# EAGLE design lvds_receiver (EAGLE 7.5.0)
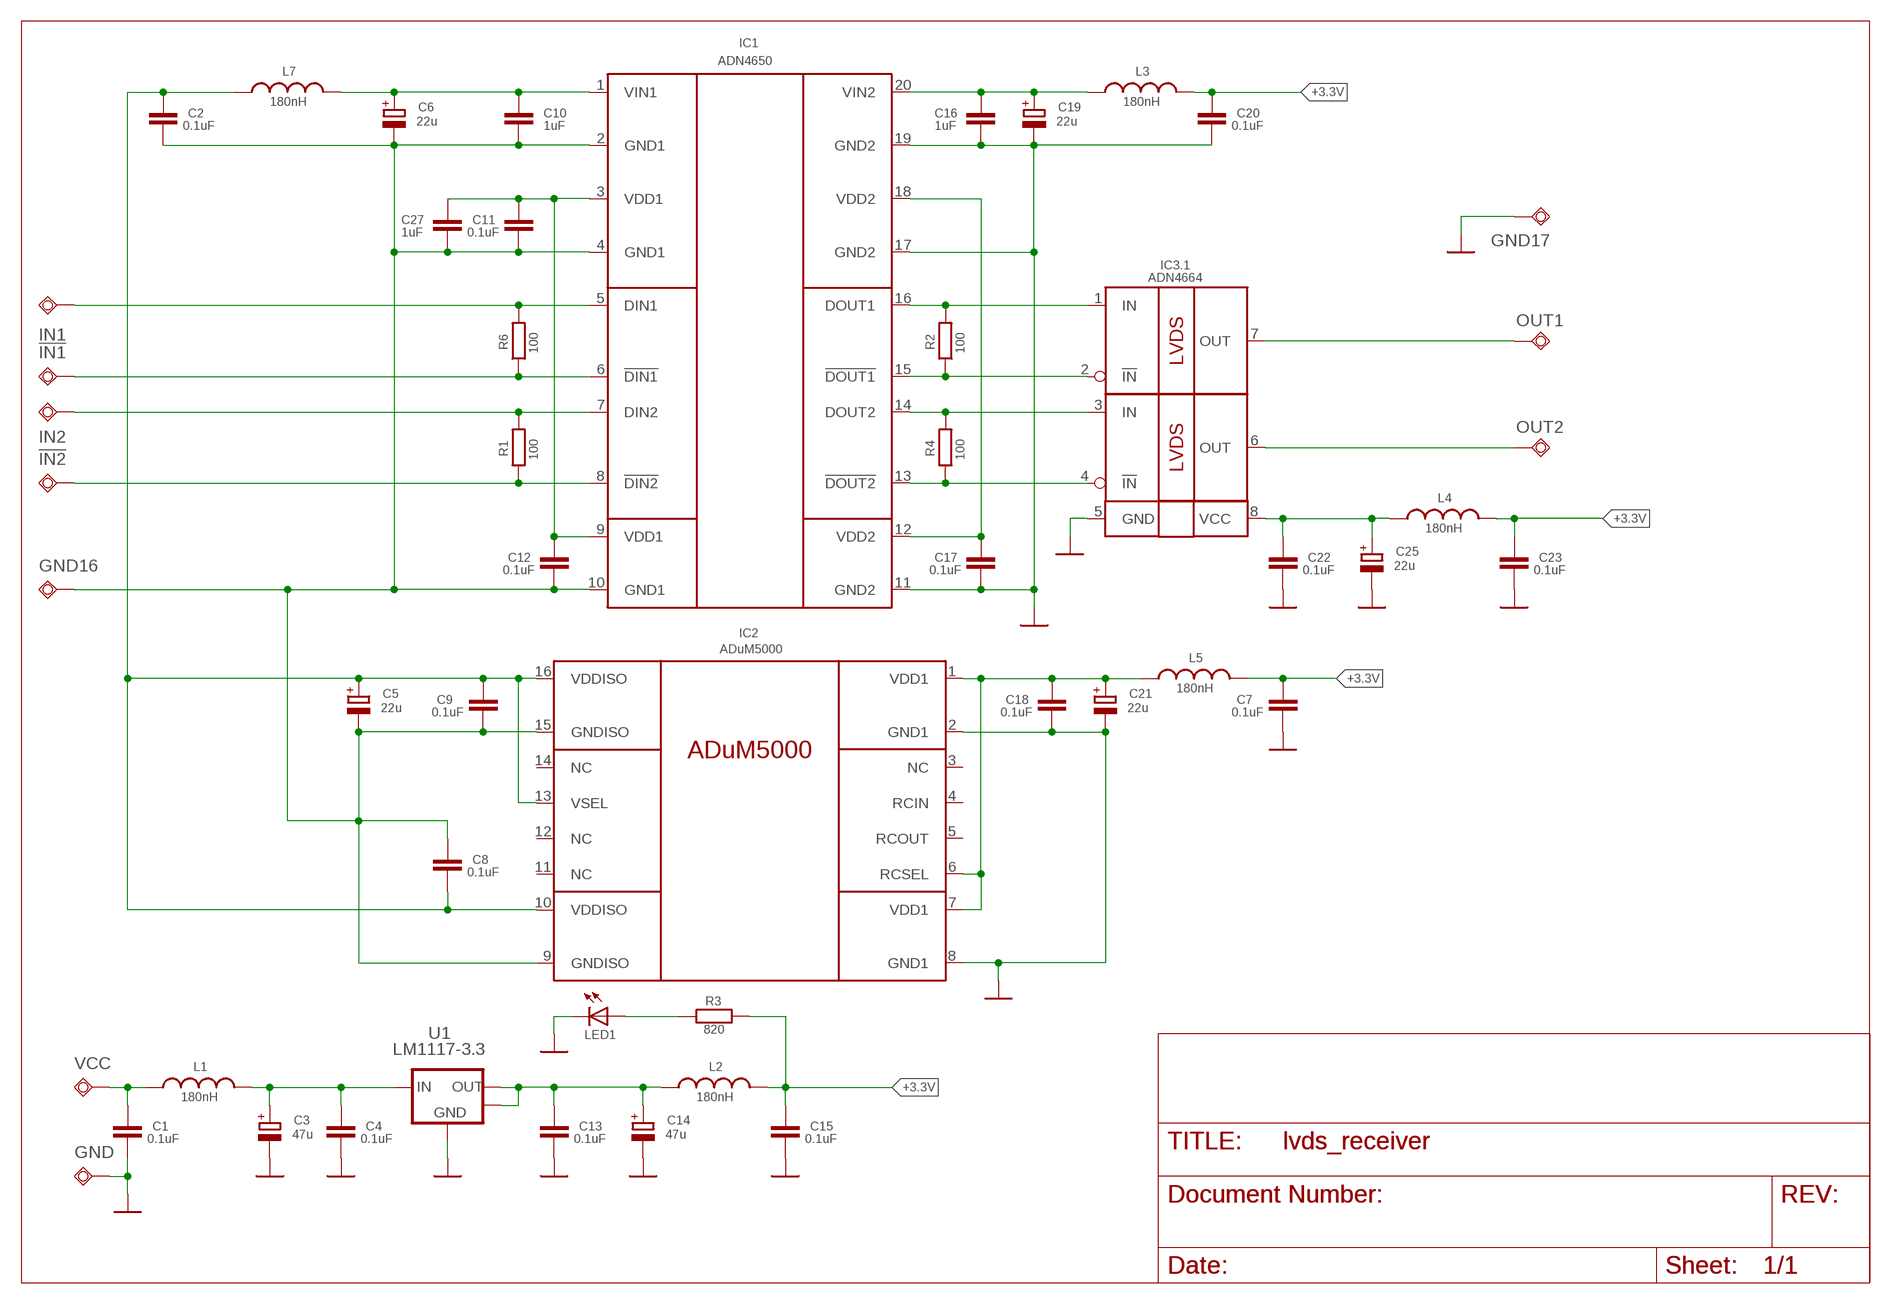
[diagram p0: schematic, sheet 1]

## Parts
!IN1  TPSQTP20R  [TP20R]
!IN2  TPSQTP20R  [TP20R]
C1  0.1uF  C0603  [SMD0603]
C2  0.1uF  C0603  [SMD0603]
C3  47u  CPOL-EUSMCC  [SMC_C]
C4  0.1uF  C0603  [SMD0603]
C5  22u  CPOL-EUSMCA  [SMC_A]
C6  22u  CPOL-EUSMCA  [SMC_A]
C7  0.1uF  C0603  [SMD0603]
C8  0.1uF  C0603  [SMD0603]
C9  0.1uF  C0603  [SMD0603]
C10  1uF  C0603  [SMD0603]
C11  0.1uF  C0603  [SMD0603]
C12  0.1uF  C0603  [SMD0603]
C13  0.1uF  C0603  [SMD0603]
C14  47u  CPOL-EUSMCC  [SMC_C]
C15  0.1uF  C0603  [SMD0603]
C16  1uF  C0603  [SMD0603]
C17  0.1uF  C0603  [SMD0603]
C18  0.1uF  C0603  [SMD0603]
C19  22u  CPOL-EUSMCA  [SMC_A]
C20  0.1uF  C0603  [SMD0603]
C21  22u  CPOL-EUSMCA  [SMC_A]
C22  0.1uF  C0603  [SMD0603]
C23  0.1uF  C0603  [SMD0603]
C25  22u  CPOL-EUSMCA  [SMC_A]
C27  1uF  C0603  [SMD0603]
GND  TPSQTP20R  [TP20R]
GND16  TPSQTP20R  [TP20R]
GND17  TPSQTP20R  [TP20R]
IC1  ADN4650  [SO20W]
IC2  ADuM5000  ADUM5000  [SO16W]
IC3  ADN4664  [SO08]
IN1  TPSQTP20R  [TP20R]
IN2  TPSQTP20R  [TP20R]
L1  180nH  L0603  [SMD0603]
L2  180nH  L0603  [SMD0603]
L3  180nH  L0603  [SMD0603]
L4  180nH  L0603  [SMD0603]
L5  180nH  L0603  [SMD0603]
L7  180nH  L0603  [SMD0603]
LED1  LEDCHIPLED_0805  [CHIPLED_0805]
OUT1  TPSQTP20R  [TP20R]
OUT2  TPSQTP20R  [TP20R]
R1  100  R0603  [SMD0603]
R2  100  R0603  [SMD0603]
R3  820  R0603  [SMD0603]
R4  100  R0603  [SMD0603]
R6  100  R0603  [SMD0603]
U1  LM1117-3.3  [SOT223]
VCC  TPSQTP20R  [TP20R]

## Nets
+3.3V: C7.1 C15.1 C20.1 C23.1 L2.2 L3.2 L4.2 L5.2 R3.2
GND: C1.2 C3.- C4.2 C7.2 C13.2 C14.- C15.2 C16.2 C17.2 C18.2 C19.- C20.2 C21.- C22.2 C23.2 C25.- GND17.TP GND.TP IC1.11(GND2) IC1.17(GND2) IC1.19(GND2) IC2.2(GND1) IC2.8(GND1) IC3.5(GND) LED1.C U1.1(GND)
GND1: C2.2 C5.- C6.- C8.1 C9.2 C10.2 C11.2 C12.2 C27.2 GND16.TP IC1.2(GND1) IC1.4(GND1) IC1.10(GND1) IC2.9(GNDISO) IC2.15(GNDISO)
N$1: IC1.5(DIN1) IN1.TP R6.2
N$2: !IN1.TP IC1.6(!DIN1) R6.1
N$3: IC1.7(DIN2) IN2.TP R1.2
N$4: !IN2.TP IC1.8(!DIN2) R1.1
N$5: IC3.7(.1:OUT) OUT1.TP
N$6: C11.1 C12.1 C27.1 IC1.3(VDD1) IC1.9(VDD1)
N$7: IC1.16(DOUT1) IC3.1(.1:IN) R2.2
N$8: IC1.14(DOUT2) IC3.3(.2:IN) R4.2
N$9: IC1.15(!DOUT1) IC3.2(.1:!IN) R2.1
N$10: IC1.13(!DOUT2) IC3.4(.2:!IN) R4.1
N$11: C2.1 C5.+ C8.2 C9.1 IC2.10(VDDISO) IC2.13(VSEL) IC2.16(VDDISO) L7.1
N$13: C6.+ C10.1 IC1.1(VIN1) L7.2
N$14: C3.+ C4.1 L1.2 U1.3(IN)
N$15: C22.1 C25.+ IC3.8(VCC) L4.1
N$16: C16.1 C19.+ IC1.20(VIN2) L3.1
N$17: C17.1 IC1.12(VDD2) IC1.18(VDD2)
N$18: IC3.6(.2:OUT) OUT2.TP
N$19: C1.1 L1.1 VCC.TP
N$20: LED1.A R3.1
NET000: C18.1 C21.+ IC2.1(VDD1) IC2.6(RCSEL) IC2.7(VDD1) L5.1
OUT: C13.1 C14.+ L2.1 U1.2(OUT) U1.4(MASS)
Unconnected: IC2.3(NC) IC2.4(RCIN) IC2.5(RCOUT) IC2.11(NC) IC2.12(NC) IC2.14(NC)

## Library data of the parts
!IN1 !IN2 GND GND16 GND17 IN1 IN2 OUT1 OUT2 VCC = testpad:TPSQ: Test pad
C1 C2 C4 C7-C13 C15-C18 C20 C22 C23 C27 = common-rcl:C
C3 C5 C6 C14 C19 C21 C25 = rcl:CPOL-EU: POLARIZED CAPACITOR, European symbol
IC1 = analog-devices:ADN4650
IC2 = analog-devices:ADUM5000: ADuM5000 edit this description Auto generated by make-symbol-device-package-bsdl.ulp Rev. 44 Source: ADuM5000.txt
IC3 = analog-devices:ADN4664
L1-L5 L7 = common-rcl:L
LED1 = led:LED: LED OSRAM: - CHIPLED LG R971, LG N971, LY N971, LG Q971, LY Q971, LO R971, LY R971 LH N974, LH R974 LS Q976, LO Q976, LY Q976 LO Q996 - Hyper CHIPLED LW Q18S LB Q993, LB Q99A, LB R99A - SideLED LS A670, LO A670, LY A670, LG A670, LP A670 LB A673, LV A673, LT A673, LW A673 LH A674 LY A675 LS A676, LA A676, LO A676, LY A676, LW A676 LS A679, LY A679, LG A679 - Hyper Micro SIDELED® LS Y876, LA Y876, LO Y876, LY Y876 LT Y87S - SmartLED LW L88C, LW L88S LB L89C, LB L89S, LG L890 LS L89K, LO L89K, LY L89K LS L896, LA L896, LO L896, LY L896 - TOPLED LS T670, LO T670, LY T670, LG T670, LP T670 LSG T670, LSP T670, LSY T670, LOP T670, LYG T670 LG T671, LOG T671, LSG T671 LB T673, LV T673, LT T673, LW T673 LH T674 LS T676, LA T676, LO T676, LY T676, LB T676, LH T676, LSB T676, LW T676 LB T67C, LV T67C, LT T67C, LS T67K, LO T67K, LY T67K, LW E67C LS E67B, LA E67B, LO E67B, LY E67B, LB E67C, LV E67C, LT E67C LW T67C LS T679, LY T679, LG T679 LS T770, LO T770, LY T770, LG T770, LP T770 LB T773, LV T773, LT T773, LW T773 LH T774 LS E675, LA E675, LY E675, LS T675 LS T776, LA T776, LO T776, LY T776, LB T776 LHGB T686 LT T68C, LB T68C - Hyper Mini TOPLED® LB M676 - Mini TOPLED Santana® LG M470 LS M47K, LO M47K, LY M47K Source: http://www.osram.convergy.de LUXEON: - LUMILED® LXK2-PW12-R00, LXK2-PW12-S00, LXK2-PW14-U00, LXK2-PW14-V00 LXK2-PM12-R00, LXK2-PM12-S00, LXK2-PM14-U00 LXK2-PE12-Q00, LXK2-PE12-R00, LXK2-PE12-S00, LXK2-PE14-T00, LXK2-PE14-U00 LXK2-PB12-K00, LXK2-PB12-L00, LXK2-PB12-M00, LXK2-PB14-N00, LXK2-PB14-P00, LXK2-PB14-Q00 LXK2-PR12-L00, LXK2-PR12-M00, LXK2-PR14-Q00, LXK2-PR14-R00 LXK2-PD12-Q00, LXK2-PD12-R00, LXK2-PD12-S00 LXK2-PH12-R00, LXK2-PH12-S00 LXK2-PL12-P00, LXK2-PL12-Q00, LXK2-PL12-R00 Source: www.luxeon.com KINGBRIGHT: KA-3528ASYC Source: www.kingbright.com
R1-R4 R6 = common-rcl:R
U1 = vreg-linear:LM1117: Linear regulators

## Board
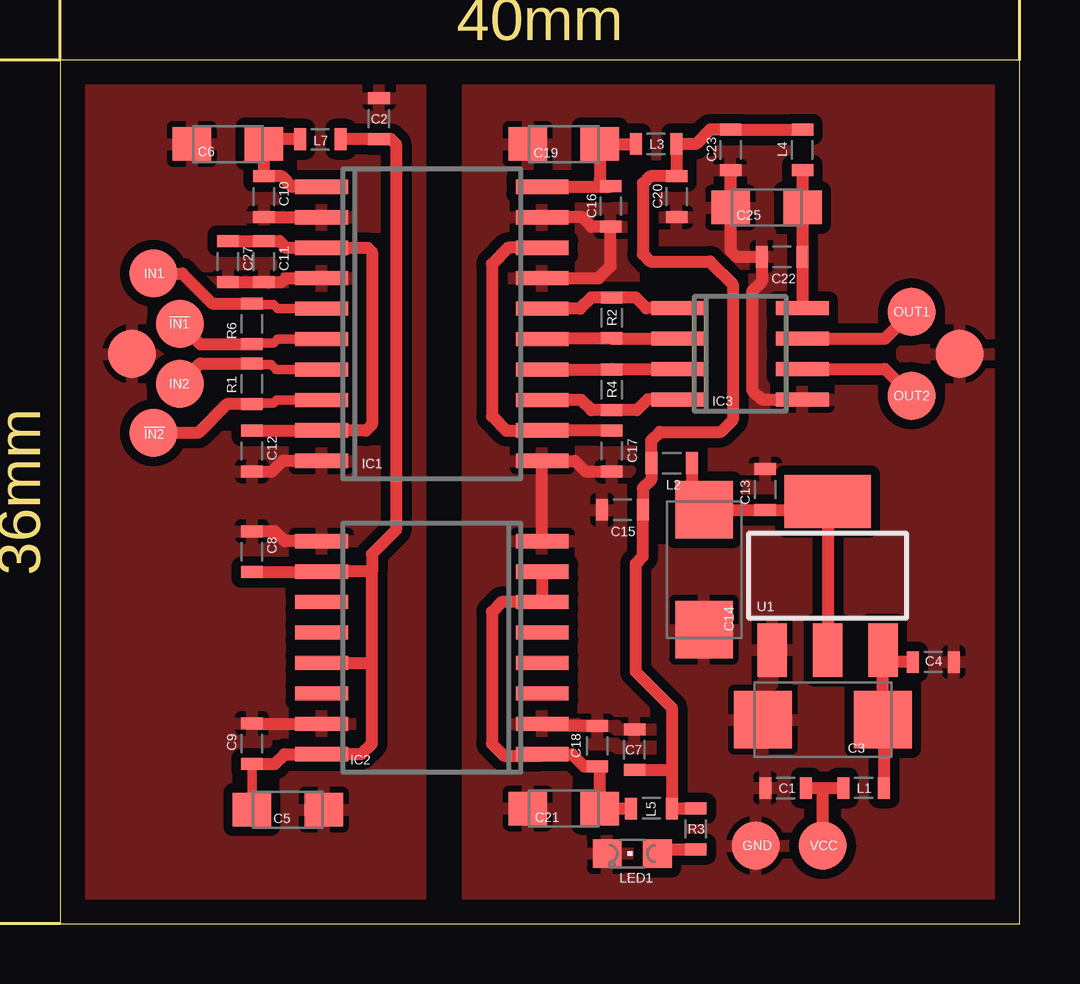
[diagram p1: board, top side]

Size 40 x 36 mm. Coordinates in mm from the lower left corner, seen from the top.
Outline: 0,0 40,0 40,36 0,36 0,0
Copper layers (1*16): Top 0.035mm / dielectric 1.5mm / Bottom 0.035mm
Design rules "default": minimum track width 10mil, minimum drill 24mil, track to track 8mil, track to pad 8mil, pad to pad 8mil, via to via 8mil, smd to smd 8mil, copper to edge 40mil, drill to drill 8mil, minimum pad ring 10mil, minimum via ring 8mil, stop-mask expansion 4mil, vias tented up to drill 0mil, thermal gap 10mil
Milling: area -3.3,34.5 to -2.7,36; area -3.3,0 to -2.7,1.5; area -2.6,15.2 to -0.8,20.8; area 38.5,38.7 to 40,39.3; area 0,38.7 to 1.5,39.3; area 17.2,36.8 to 22.8,38.6; 6 lines

### Footprints (pad centres in the part's own frame; a part is rotated, then mirrored left to right if it is on the bottom)
TP20R = smd 2 x 2: TP 0,0
SMD0603 = smd 0.5 x 0.9: 1 -0.85,0; 2 0.85,0
SMC_C = smd 2.4 x 2.4: + -2.5,0; - 2.5,0
SMC_A = smd 1.6 x 1.4: + -1.5,0; - 1.5,0
SO20W = smd 0.6 x 2.2: 1 -5.715,-4.6; 2 -4.445,-4.6; 3 -3.175,-4.6; 4 -1.905,-4.6; 5 -0.635,-4.6; 6 0.635,-4.6; 7 1.905,-4.6; 8 3.175,-4.6; 9 4.445,-4.6; 10 5.715,-4.6; 11 5.715,4.6; 12 4.445,4.6; 13 3.175,4.6; 14 1.905,4.6; 15 0.635,4.6; 16 -0.635,4.6; 17 -1.905,4.6; 18 -3.175,4.6; 19 -4.445,4.6; 20 -5.715,4.6
SO16W = smd 0.6 x 2.2: 1 -4.445,-4.6; 2 -3.175,-4.6; 3 -1.905,-4.6; 4 -0.635,-4.6; 5 0.635,-4.6; 6 1.905,-4.6; 7 3.175,-4.6; 8 4.445,-4.6; 9 4.445,4.6; 10 3.175,4.6; 11 1.905,4.6; 12 0.635,4.6; 13 -0.635,4.6; 14 -1.905,4.6; 15 -3.175,4.6; 16 -4.445,4.6
SO08 = smd 0.6 x 2.2: 1 -1.905,-2.6; 2 -0.635,-2.6; 3 0.635,-2.6; 4 1.905,-2.6; 5 1.905,2.6; 6 0.635,2.6; 7 -0.635,2.6; 8 -1.905,2.6
CHIPLED_0805 = smd 1.2 x 1.2: A 0,-1.05; C 0,1.05
SOT223 = smd 1.219 x 2.235: 1 -2.311,-3.099; 2 0,-3.099; 3 2.311,-3.099 | smd 3.6 x 2.2: 4 0,3.099

### Placement (x,y rotation side)
!IN1  5,25 0 top
!IN2  3.9,20.45 0 top
C1  30.25,5.65 180 top
C2  13.3,33.55 90 top
C3  31.8,8.5 180 top
C4  36.4,10.9 0 top
C5  9.5,4.75 0 top
C6  7,32.5 180 top
C7  23.95,7.25 90 top
C8  8,15.5 270 top
C9  8,7.5 90 top
C10  8.5,30.3 270 top
C11  8.5,27.6 270 top
C12  8,19.7 270 top
C13  29.4,18.1 90 top
C14  26.85,14.75 270 top
C15  23.45,17.25 180 top
C16  22.95,29.9 270 top
C17  23,19.7 270 top
C18  22.4,7.4 90 top
C19  21,32.5 180 top
C20  25.7,30.3 270 top
C21  21,4.8 180 top
C22  30.1,27.8 180 top
C23  27.95,32.25 270 top
C25  29.45,29.85 180 top
C27  7,27.6 270 top
GND  29,3.25 0 top
GND16  3,23.75 0 top
GND17  37.5,23.75 0 top
IC1  15.5,25 270 top
IC2  15.5,11.5 90 top
IC3  28.35,23.75 270 top
IN1  3.9,27.1 0 top
IN2  5,22.5 0 top
L1  33.5,5.65 0 top
L2  25.5,19.2 180 top
L3  24.85,32.5 0 top
L4  30.95,32.25 90 top
L5  24.65,4.8 0 top
L7  10.85,32.7 180 top
LED1  23.86,2.92 90 top
OUT1  35.5,25.5 0 top
OUT2  35.5,22 0 top
R1  8,22.5 90 top
R2  23,25.25 90 top
R3  26.5,3.95 90 top
R4  23,22.25 90 top
R6  8,25 90 top
U1  32,14.5 0 top
VCC  31.8,3.25 90 top

### Tracks (layer width: path | path; a pad name or v marks a point on that pad's centre or on a via)
+3.3V
  Top 0.5: L4.2 C23.1 27.1,33.1 26.5,32.5 L3.2 C20.1 24.6,31.15 24.3,30.85 24.3,27.9 24.6,27.6 27.1,27.6 28.05,26.65 28.05,21 27.55,20.5 25,20.5 24.65,20.15 L2.2 24.65,18.5 24.3,18.15 C15.1 24.3,15.3 24,15 24,10.5 25.5,9 25.5,6.5 | R3.2 L5.2 25.5,6.5 | C7.1 25.4,6.4 25.5,6.5
GND
  Top 0.5: IC1.19 21.75,29.45 22.15,29.05 C16.2 22.95,27.4 22.45,26.91 IC1.17 | C17.2 21.9,18.85 21.46,19.29 IC1.11 IC2.8 | IC3.5 29.25,21.85 28.85,22.25 28.85,26.35 29.25,26.75 C22.2 28.2,27.8 27.95,28.05 C25.- C23.2 | C18.2 20.18,8.25 arc-90 IC2.2
  pour Top (isolate 0.4, rank 6): 17,36 40,36 39.5,0 17,0
GND1
  Top 0.5: C10.2 IC1.2 | IC1.4 9.4,26.9 9.25,26.75 C11.2 C27.2 | C12.2 8.85,18.85 9.3,19.3 10.88,19.3 arc-90 IC1.10 | C9.2 8.03,8.32 IC2.15 | IC2.9 9.36,15.95 8.95,16.35 C8.1
  pour Top (isolate 0.4, rank 6): 0,36 15,36 15,0 0,0
N$1
  Top 0.4: IC1.5 9.06,25.64 8.9,25.8 8.05,25.8 R6.2
  Top 0.5: IN1.TP 5.1,27.1 6.35,25.85 R6.2
N$2
  Top 0.4: IC1.6 9.06,24.36 8.9,24.2 8.05,24.2 R6.1
  Top 0.5: !IN1.TP 5.85,24.15 R6.1
N$3
  Top 0.4: IC1.7 9.01,23.09 8.8,23.3 8.05,23.3 R1.2
  Top 0.5: IN2.TP 5.85,23.35 R1.2
N$4
  Top 0.4: IC1.8 9.03,21.82 8.9,21.7 8.05,21.7 R1.1
  Top 0.5: R1.1 6.95,21.65 5.75,20.45 !IN2.TP
N$5
  Top 0.5: IC3.7 34.38,24.39 OUT1.TP
N$6
  Top 0.5: C27.1 C11.1 9.15,28.45 9.43,28.18 IC1.3 12.82,28.18 13,28 13,20.8 12.75,20.55 IC1.9 C12.1
N$7
  Top 0.5: IC1.16 21.68,25.64 22.15,26.1 R2.2 24,26.1 24.45,25.66 IC3.1
N$8
  Top 0.5: IC1.14 R4.2 23.02,23.11 IC3.3
N$9
  Top 0.5: IC1.15 20.14,24.4 R2.1 23.02,24.39 IC3.2
N$10
  Top 0.5: IC3.4 24.5,21.84 24.05,21.4 R4.1 22.15,21.4 21.73,21.82 IC1.13
N$11
  Top 0.4: C9.1 C5.+
  Top 0.5: C9.1 8.95,6.65 9.36,7.05 IC2.16 12.55,7.05 13,7.5 13,11 | C8.2 10.88,14.65 IC2.10 13,14.68 | IC2.13 12.87,10.87 arc90 13,11 | 13,11 13,14.68 | 13,14.68 13,15.4 14,16.4 14,32.5 13.8,32.7 C2.1 L7.1
N$13
  Top 0.5: IC1.1 9.69,30.71 9.25,31.15 C10.1 C6.+ 8.5,32.7 L7.2
N$14
  Top 0.5: C4.1 34.81,10.9 U1.3 C3.+ 34.35,8.45 L1.2
N$15
  Top 0.5: IC3.8 C22.1 C25.+ L4.1
N$16
  Top 0.5: IC1.20 22.91,30.71 C16.1 arc-122 22.5,31 C19.+ L3.1
N$17
  Top 0.5: C17.1 IC1.12 18.6,20.55 18,21.15 18,27.5 18.68,28.18 IC1.18
N$18
  Top 0.5: IC3.6 34.38,23.11 OUT2.TP
N$19
  Top 0.5: C1.1 31.8,5.65 | 31.8,5.65 L1.1 | VCC.TP 31.8,5.65
N$20
  Top 0.5: LED1.A 25.09,3.1 R3.1
NET000
  Top 0.5: IC2.7 IC2.6 18.41,13.4 18,13 18,7.5 18.5,7 20.05,7 IC2.1 21.34,7.05 21.85,6.55 C18.1 22.5,6.45 C21.+ L5.1
OUT
  Top 0.5: L2.1 26.35,17.75 C14.+ C13.1 31.65,17.25 U1.4 U1.2